# EAGLE schematic 7seg247b (EAGLE 6.6.0)
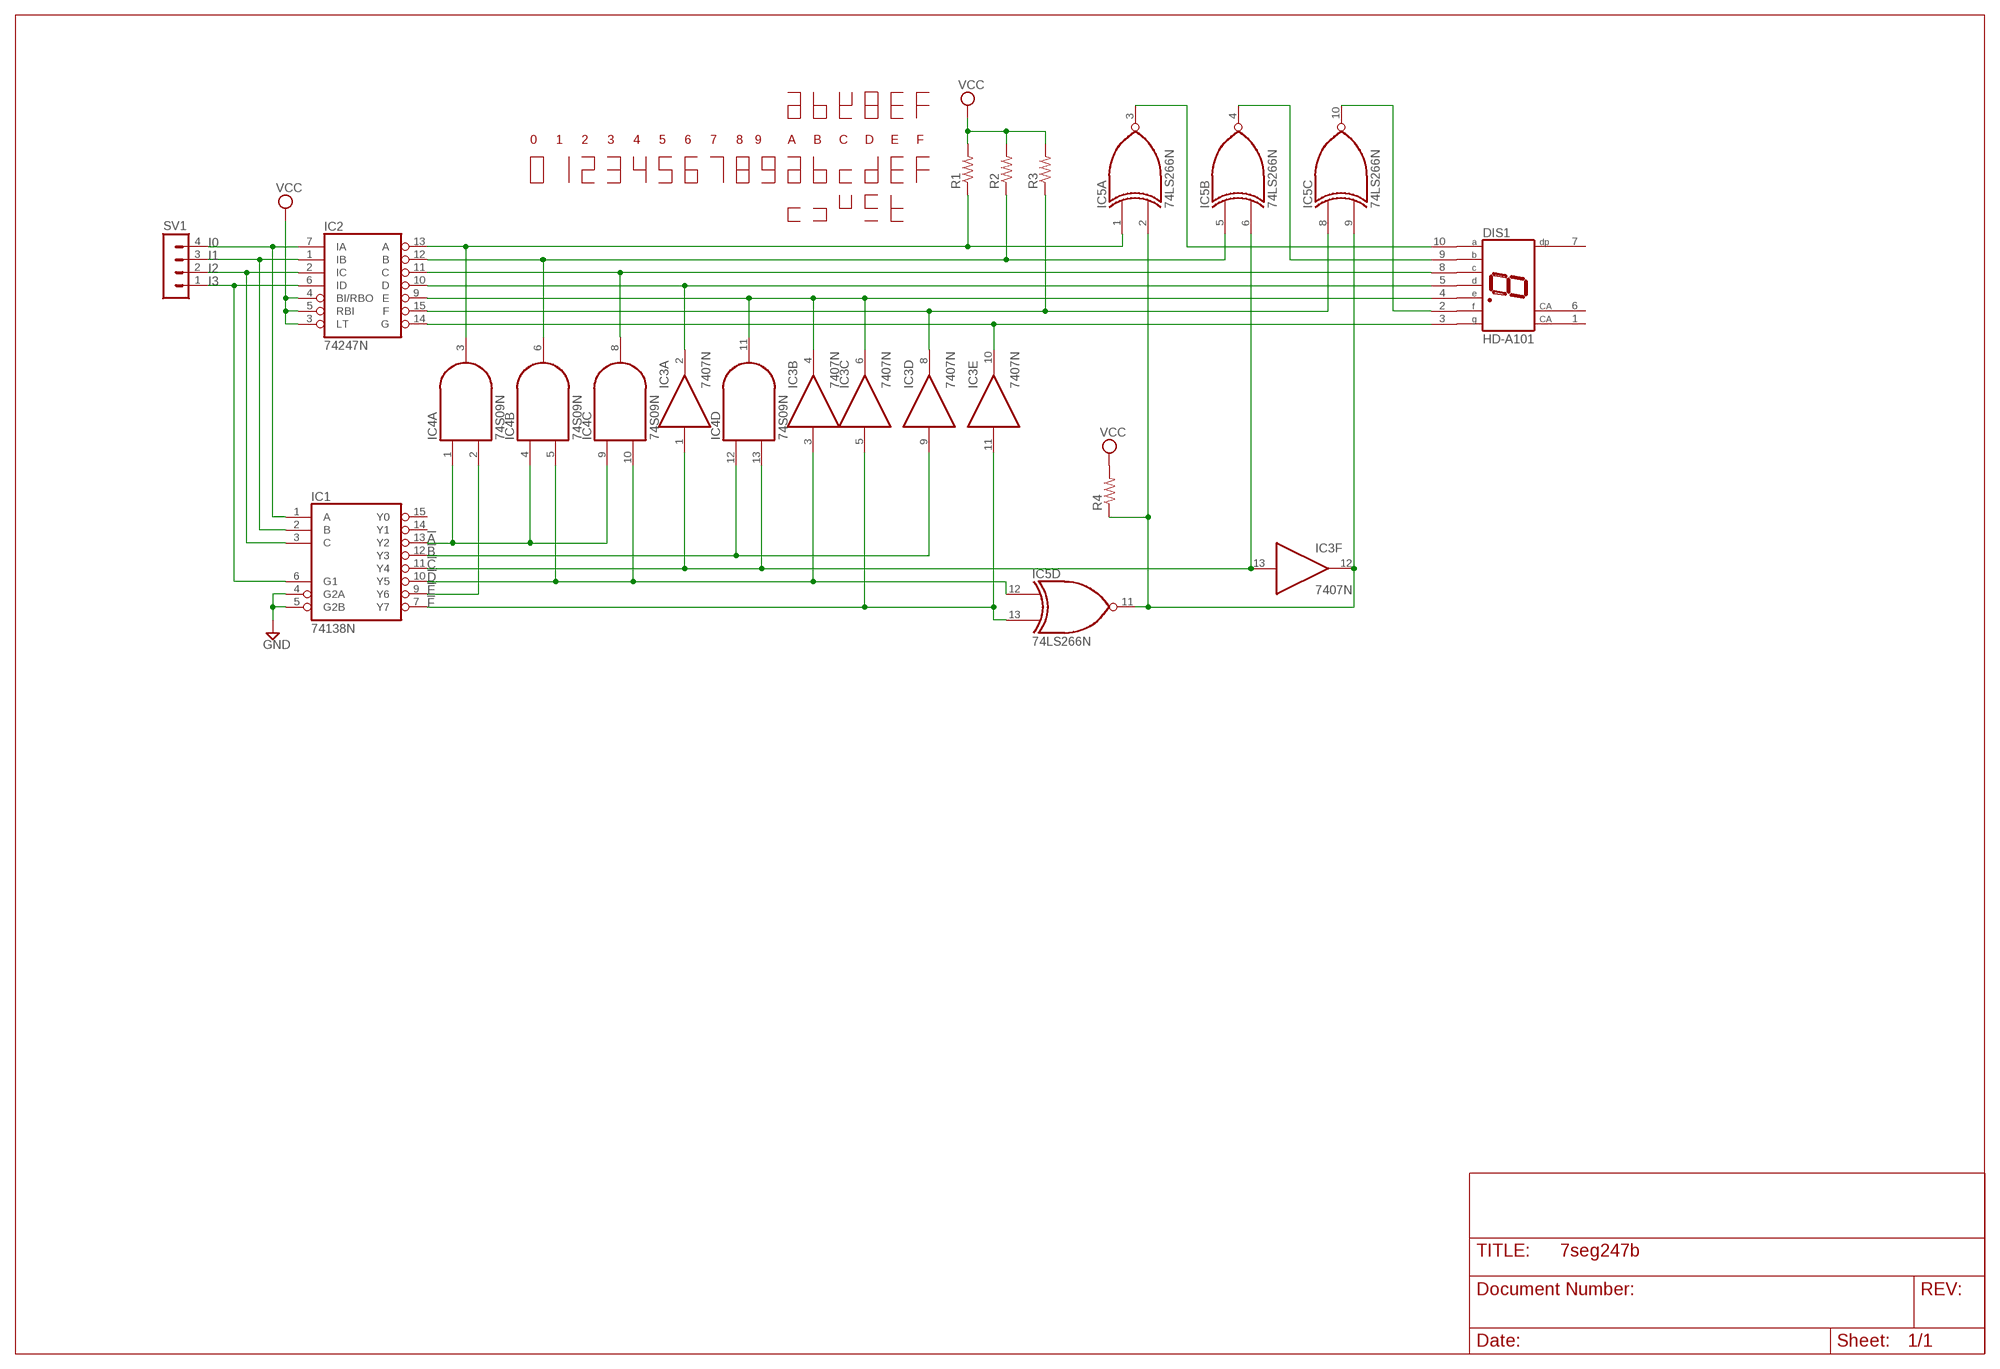
[diagram p0: schematic, sheet 1]

## Parts
DIS1  HD-A101  [HDSP-A]
IC1  74138N  74S138N  [DIL16]
IC2  74247N  7446N  [DIL16]
IC3  7407N  [DIL14]
IC4  74S09N  [DIL14]
IC5  74LS266N  [DIL14]
R1  R-US_0207/10  [0207/10]
R2  R-US_0207/10  [0207/10]
R3  R-US_0207/10  [0207/10]
R4  R-US_0207/10  [0207/10]
SV1  MA04-1  [MA04-1]

## Nets
!A: IC1.13(Y2) IC4.1(A:I0) IC4.4(B:I0) IC4.9(C:I0)
!B: IC1.12(Y3) IC3.9(D:I) IC4.12(D:I0)
!C: IC1.11(Y4) IC3.1(A:I) IC3.13(F:I) IC4.13(D:I1) IC5.6(B:I1)
!D: IC1.10(Y5) IC3.3(B:I) IC4.5(B:I1) IC4.10(C:I1) IC5.12(D:I0)
!E: IC1.9(Y6) IC4.2(A:I1)
!F: IC1.7(Y7) IC3.5(C:I) IC3.11(E:I) IC5.13(D:I1)
GND: IC1.4(G2A) IC1.5(G2B)
I0: IC1.1(A) IC2.7(IA) SV1.4
I1: IC1.2(B) IC2.1(IB) SV1.3
I2: IC1.3(C) IC2.2(IC) SV1.2
I3: IC1.6(G1) IC2.6(ID) SV1.1
N$1: IC3.12(F:O) IC5.2(A:I1) IC5.9(C:I1) IC5.11(D:O) R4.1
N$2: DIS1.10(A) IC5.3(A:O)
N$3: DIS1.9(B) IC5.4(B:O)
N$4: IC2.13(A) IC4.3(A:O) IC5.1(A:I0) R1.1
N$5: DIS1.2(F) IC5.10(C:O)
N$6: DIS1.8(C) IC2.11(C) IC4.8(C:O)
N$7: DIS1.5(D) IC2.10(D) IC3.2(A:O)
N$8: DIS1.4(E) IC2.9(E) IC3.4(B:O) IC3.6(C:O) IC4.11(D:O)
N$9: IC2.15(F) IC3.8(D:O) IC5.8(C:I0) R3.1
N$10: DIS1.3(G) IC2.14(G) IC3.10(E:O)
N$11: IC2.12(B) IC4.6(B:O) IC5.5(B:I0) R2.1
VCC: IC2.3(LT) IC2.4(BI/RBO) IC2.5(RBI) R1.2 R2.2 R3.2 R4.2
Unconnected: DIS1.1(CA) DIS1.6(CA) DIS1.7(DP) IC1.14(Y1) IC1.15(Y0)

## Notes on the sheet
- 0 | 1 | 2 | 3 | 4 | 5 | 6 | 7 | 8 | 9 | A | B | C | D | E | F

## Power pins joined to a net without a drawn wire
GND: IC1.8(GND) IC2.8(GND) IC3.7(P:GND) IC4.7(P:GND) IC5.7(P:GND)
VCC: IC1.16(VCC) IC2.16(VCC) IC3.14(P:VCC) IC4.14(P:VCC) IC5.14(P:VCC)

## Library data of the parts
DIS1 = display-hp:HD-A101: LED DISPLAY 1-character 7 segment, decimal point right; OC_FARNELL: unknown; OC_NEWARK: unknown
IC1 = 74xx-us:74*138: 3-line to 8-line DECODER/DEMULTIPLEXER
IC2 = 74xx-us:74*46: BCD to seven segment DECODER/DRIVER, open collector
IC3 = 74xx-us:74*07: Hex BUFFER, open collector high-voltage output
IC4 = 74xx-us:74*09: Quad 2-input AND gate, open collector
IC5 = 74xx-us:74*266: Quadruple EXCLUSIVE-NOR (XNOR), open-collector
R1-R4 = rcl:R-US_: RESISTOR, American symbol
SV1 = con-lstb:MA04-1: PIN HEADER; OC_FARNELL: unknown; OC_NEWARK: unknown